# EAGLE design Parallel (EAGLE 7.6.0)
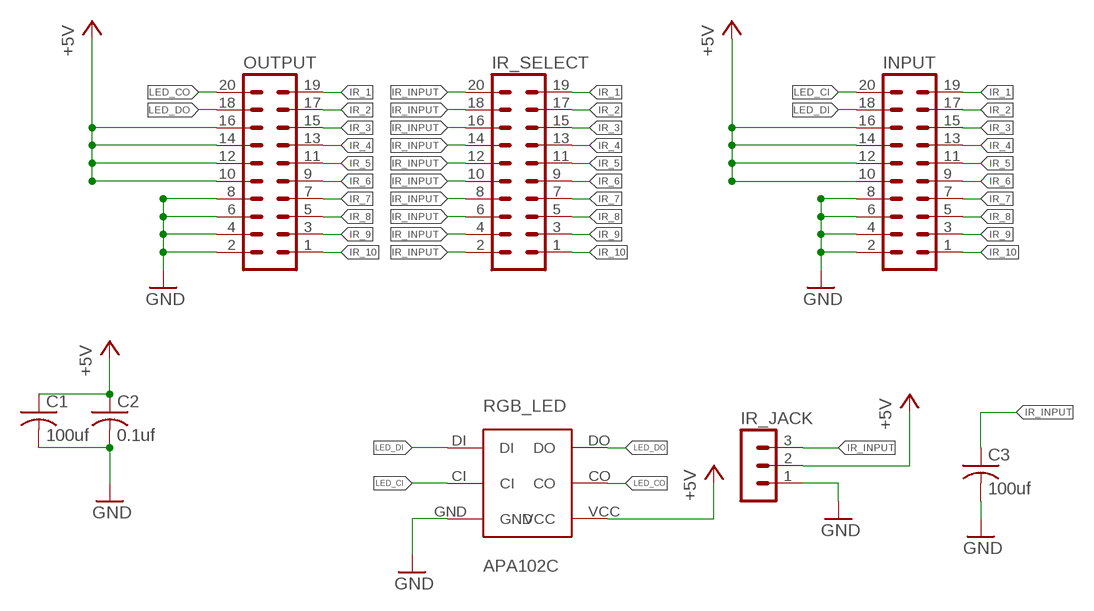
[diagram p0: schematic, sheet 1]

## Parts
C1  100uf  C-USC0805  [C0805]
C2  0.1uf  C-USC0603  [C0603]
C3  100uf  C-USC0805  [C0805]
INPUT  MA10-2  [MA10-2]
IR_JACK  MA03-1  [MA03-1]
IR_SELECT  MA10-2  [MA10-2]
OUTPUT  MA10-2  [MA10-2]
RGB_LED  APA102C  [APA102C]

## Nets
+5V: C1.1 C2.1 INPUT.10 INPUT.12 INPUT.14 INPUT.16 IR_JACK.2 OUTPUT.10 OUTPUT.12 OUTPUT.14 OUTPUT.16 RGB_LED.VCC
GND: C1.2 C2.2 C3.2 INPUT.2 INPUT.4 INPUT.6 INPUT.8 IR_JACK.1 OUTPUT.2 OUTPUT.4 OUTPUT.6 OUTPUT.8 RGB_LED.GND
IR_1: INPUT.19 IR_SELECT.19 OUTPUT.19
IR_2: INPUT.17 IR_SELECT.17 OUTPUT.17
IR_3: INPUT.15 IR_SELECT.15 OUTPUT.15
IR_4: INPUT.13 IR_SELECT.13 OUTPUT.13
IR_5: INPUT.11 IR_SELECT.11 OUTPUT.11
IR_6: INPUT.9 IR_SELECT.9 OUTPUT.9
IR_7: INPUT.7 IR_SELECT.7 OUTPUT.7
IR_8: INPUT.5 IR_SELECT.5 OUTPUT.5
IR_9: INPUT.3 IR_SELECT.3 OUTPUT.3
IR_10: INPUT.1 IR_SELECT.1 OUTPUT.1
IR_INPUT: C3.1 IR_JACK.3 IR_SELECT.2 IR_SELECT.4 IR_SELECT.6 IR_SELECT.8 IR_SELECT.10 IR_SELECT.12 IR_SELECT.14 IR_SELECT.16 IR_SELECT.18 IR_SELECT.20
LED_CI: INPUT.20 RGB_LED.CI
LED_CO: OUTPUT.20 RGB_LED.CO
LED_DI: INPUT.18 RGB_LED.DI
LED_DO: OUTPUT.18 RGB_LED.DO

## Library data of the parts
C1-C3 = rcl:C-US: CAPACITOR, American symbol
INPUT IR_SELECT OUTPUT = con-lstb:MA10-2: PIN HEADER; OC_FARNELL: unknown; OC_NEWARK: unknown
IR_JACK = con-lstb:MA03-1: PIN HEADER; OC_FARNELL: unknown; OC_NEWARK: unknown
RGB_LED = APA102C:APA102C

## Board
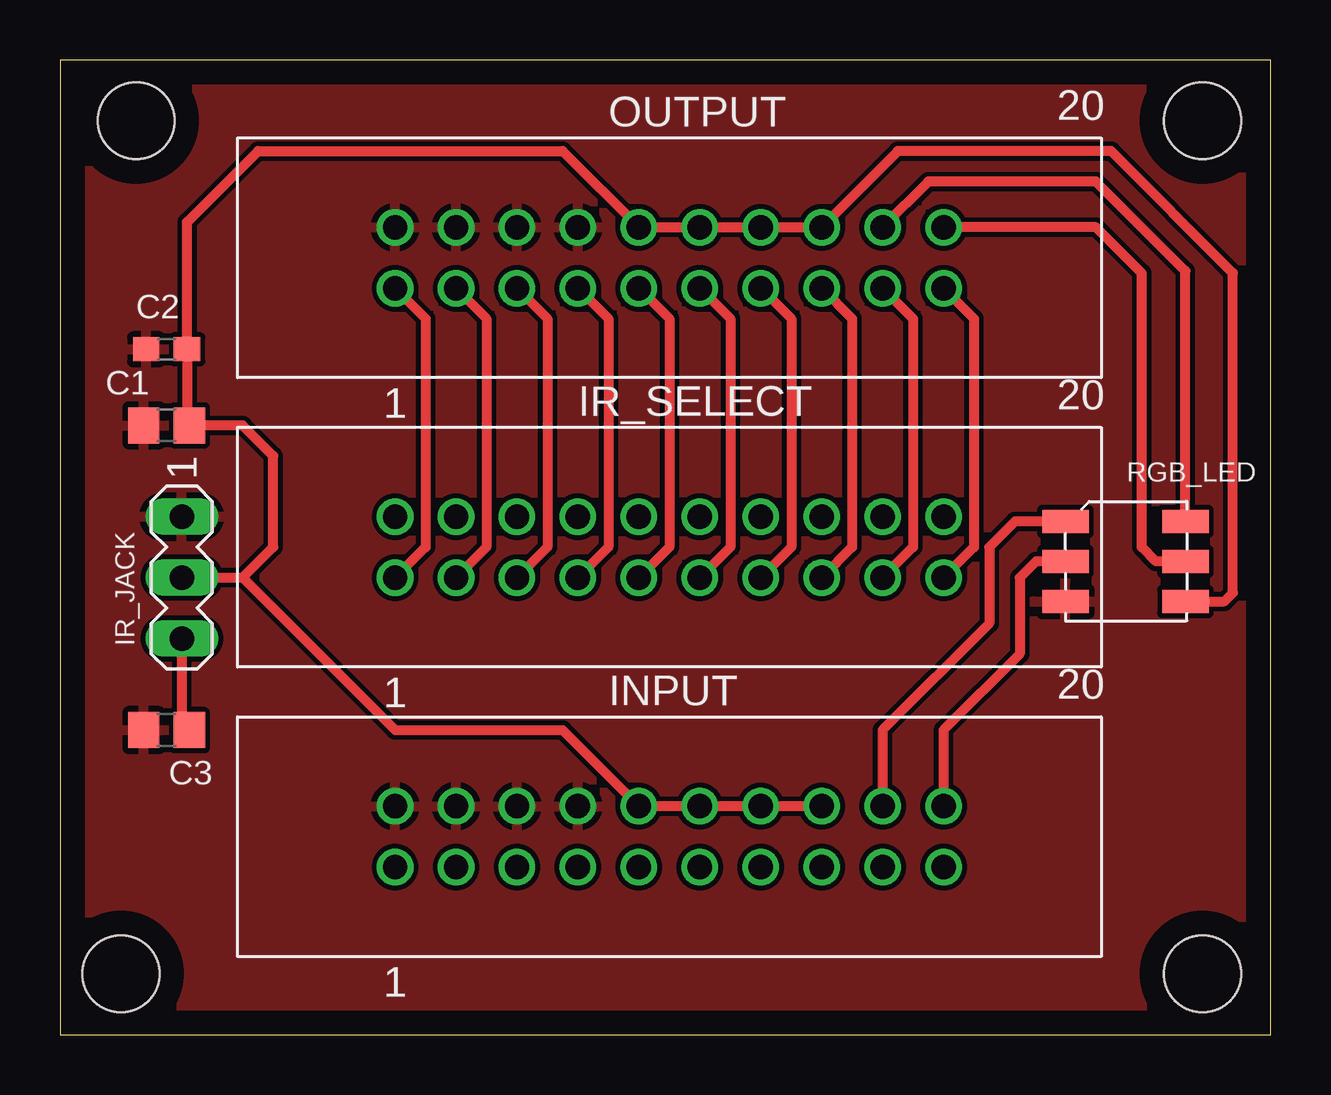
[diagram p1: board, top side]
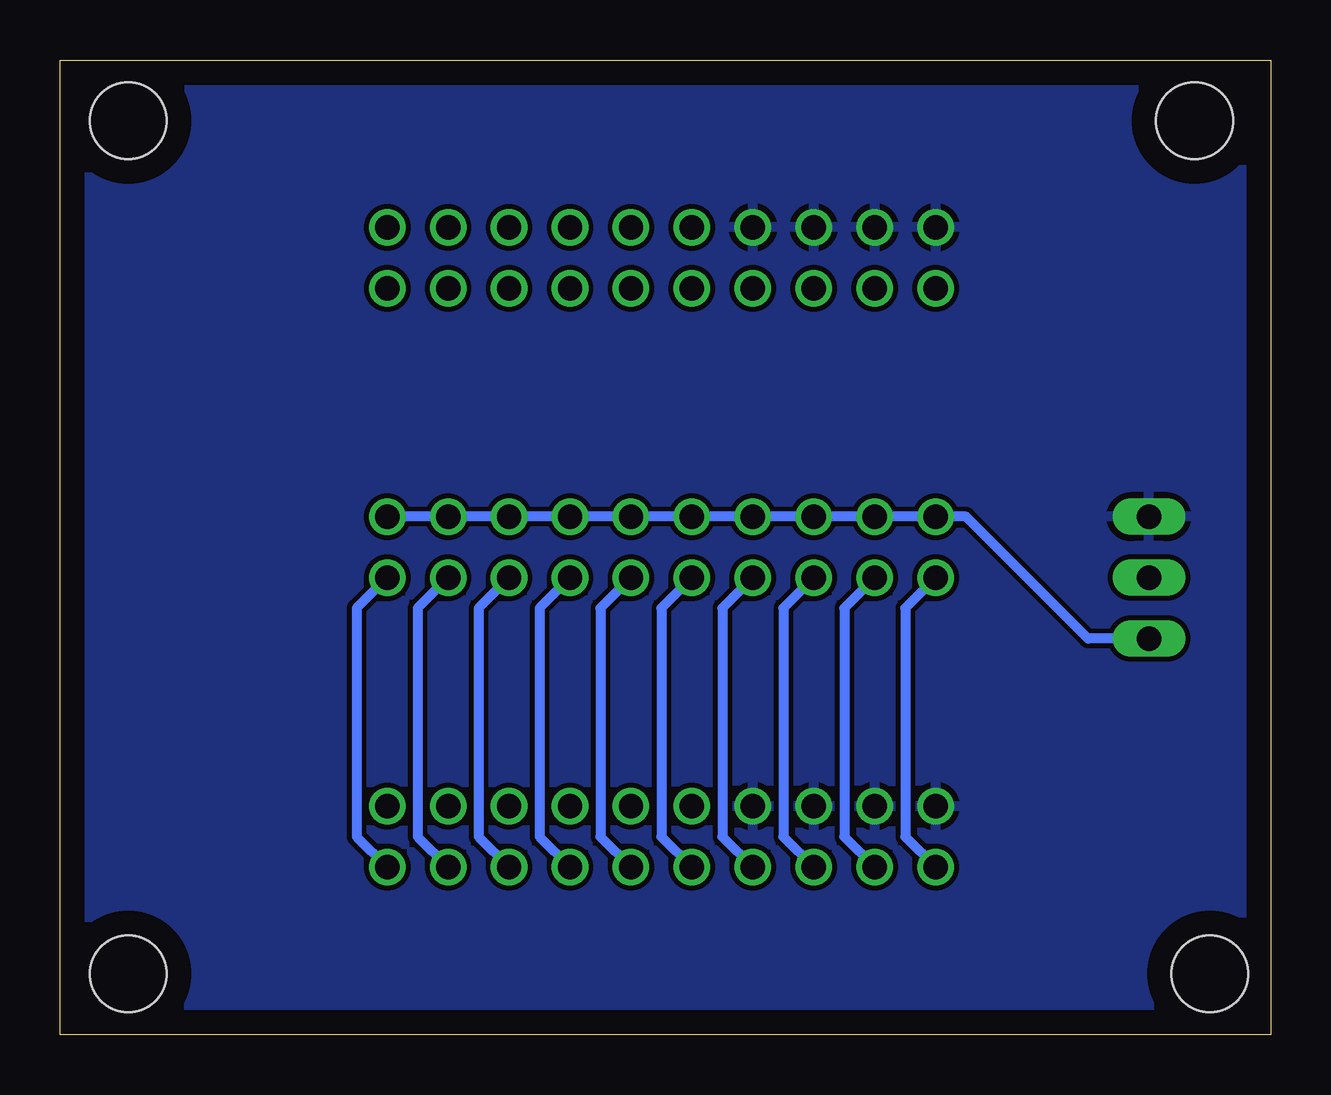
[diagram p2: board, bottom side, seen from below]

Size 50.47 x 40.63 mm. Coordinates in mm from the lower left corner, seen from the top.
Outline: 0,0 50.47,0 50.47,40.63 0,40.63 0,0
Copper layers (1*16): Top 0.035mm / dielectric 1.5mm / Bottom 0.035mm
Design rules "default": minimum track width 10mil, minimum drill 24mil, track to track 8mil, track to pad 8mil, pad to pad 8mil, via to via 8mil, smd to smd 8mil, copper to edge 40mil, drill to drill 8mil, minimum pad ring 10mil, minimum via ring 8mil, stop-mask expansion 4mil, vias tented up to drill 0mil, thermal gap 10mil
Holes 3.2 mm at 2.54,2.54 3.17,38.1 47.62,38.1 47.62,2.54

### Footprints (pad centres in the part's own frame; a part is rotated, then mirrored left to right if it is on the bottom)
C0805 = smd 1.3 x 1.5: 1 -0.95,0; 2 0.95,0
C0603 = smd 1.1 x 1: 1 -0.85,0; 2 0.85,0
MA10-2 = drill 1.016: 1 -11.43,-1.27; 2 -11.43,1.27; 3 -8.89,-1.27; 4 -8.89,1.27; 5 -6.35,-1.27; 6 -6.35,1.27; 7 -3.81,-1.27; 8 -3.81,1.27; 9 -1.27,-1.27; 10 -1.27,1.27; 11 1.27,-1.27; 12 1.27,1.27; 13 3.81,-1.27; 14 3.81,1.27; 15 6.35,-1.27; 16 6.35,1.27; 17 8.89,-1.27; 18 8.89,1.27; 19 11.43,-1.27; 20 11.43,1.27
MA03-1 = drill 1.016 long: 1 -2.54,0; 2 0,0; 3 2.54,0
APA102C = smd 1.93 x 0.965: CI 0,-2.5; CO 5,-2.5; DI 0,-0.833; DO 5,-0.833; GND 0,-4.167; VCC 5,-4.167

### Placement (x,y rotation side)
C1  4.45,25.4 180 top
C2  4.45,28.57 180 top
C3  4.45,12.7 180 top
INPUT  25.4,8.26 0 top
IR_JACK  5.08,19.05 270 top
IR_SELECT  25.4,20.32 0 top
OUTPUT  25.4,32.38 0 top
RGB_LED  41.91,22.23 0 top

### Tracks (layer width: path | path; a pad name or v marks a point on that pad's centre or on a via)
+5V
  Top 0.406: INPUT.16 INPUT.14 INPUT.12 INPUT.10 20.95,12.7 13.97,12.7 7.62,19.05 | RGB_LED.VCC 48.54,18.06 48.9,18.41 48.9,31.75 43.81,36.83 34.92,36.83 OUTPUT.16 OUTPUT.14 OUTPUT.12 OUTPUT.10 20.95,36.83 8.26,36.83 5.29,33.87 C2.1 5.29,25.5 C1.1 7.62,25.4 8.89,24.13 8.89,20.32 7.62,19.05 | IR_JACK.2 7.62,19.05
GND
  pour Top: 0,40.64 50.8,40.64 50.8,0 0,0
  pour Bottom: 0,40.64 50.8,40.64 50.8,0 0,0
IR_1
  Top 0.406: OUTPUT.19 38.1,29.84 38.1,20.32 IR_SELECT.19
  Bottom 0.406: IR_SELECT.19 38.1,17.78 38.1,8.26 INPUT.19
IR_2
  Top 0.406: OUTPUT.17 35.56,29.84 35.56,20.32 IR_SELECT.17
  Bottom 0.406: IR_SELECT.17 35.56,17.78 35.56,8.26 INPUT.17
IR_3
  Top 0.406: OUTPUT.15 33.02,29.84 33.02,20.32 IR_SELECT.15
  Bottom 0.406: IR_SELECT.15 33.02,17.78 33.02,8.26 INPUT.15
IR_4
  Top 0.406: OUTPUT.13 30.48,29.84 30.48,20.32 IR_SELECT.13
  Bottom 0.406: IR_SELECT.13 30.48,17.78 30.48,8.26 INPUT.13
IR_5
  Top 0.406: OUTPUT.11 27.94,29.84 27.94,20.32 IR_SELECT.11
  Bottom 0.406: IR_SELECT.11 27.94,17.78 27.94,8.26 INPUT.11
IR_6
  Top 0.406: OUTPUT.9 25.4,29.84 25.4,20.32 IR_SELECT.9
  Bottom 0.406: IR_SELECT.9 25.4,17.78 25.4,8.26 INPUT.9
IR_7
  Top 0.406: OUTPUT.7 22.86,29.84 22.86,20.32 IR_SELECT.7
  Bottom 0.406: IR_SELECT.7 22.86,17.78 22.86,8.26 INPUT.7
IR_8
  Top 0.406: OUTPUT.5 20.32,29.84 20.32,20.32 IR_SELECT.5
  Bottom 0.406: IR_SELECT.5 20.32,17.78 20.32,8.26 INPUT.5
IR_9
  Top 0.406: OUTPUT.3 17.78,29.84 17.78,20.32 IR_SELECT.3
  Bottom 0.406: IR_SELECT.3 17.78,17.78 17.78,8.26 INPUT.3
IR_10
  Top 0.406: OUTPUT.1 15.24,29.84 15.24,20.32 IR_SELECT.1
  Bottom 0.406: IR_SELECT.1 15.24,17.78 15.24,8.26 INPUT.1
IR_INPUT
  Top 0.406: IR_JACK.3 5.08,13.02 C3.1
  Bottom 0.406: IR_SELECT.20 IR_SELECT.18 IR_SELECT.16 IR_SELECT.14 IR_SELECT.12 IR_SELECT.10 IR_SELECT.8 IR_SELECT.6 IR_SELECT.4 IR_SELECT.2 12.7,21.59 7.62,16.51 IR_JACK.3
LED_CI
  Top 0.406: RGB_LED.CI 40.68,19.73 40.01,19.05 40.01,15.88 36.83,12.7 INPUT.20
LED_CO
  Top 0.406: RGB_LED.CO 45.68,19.73 45.09,20.32 45.09,31.75 43.18,33.66 OUTPUT.20
LED_DI
  Top 0.406: RGB_LED.DI 39.81,21.39 38.73,20.32 38.73,17.14 34.29,12.7 INPUT.18
LED_DO
  Top 0.406: RGB_LED.DO 46.91,31.83 43.18,35.56 36.2,35.56 OUTPUT.18